# Altium schematic sheet P13_ETH3_USB.SchDoc
size 297 x 209 mm
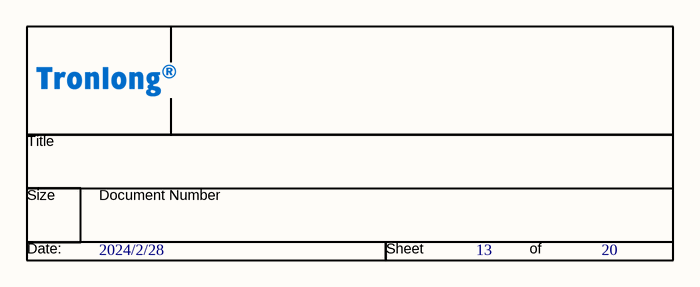
[diagram p0: P13_ETH3_USB.SchDoc]

## Parts
*  Page Count: 20  Page Number: 13  Page Modify Date: 2024/2/28  (hidden comment: Tronlong_TITTLE_20211115)  (graphical)

## Notes on the sheet
- (in symbol Tronlong_TITTLE_20211115) Title; Size; Document Number; Date:; Sheet; of

## Library data of the parts
* = Tronlong_TITTLE_20211115: RevCode: A?; Page Create Date: March  8, 1995